# Altium project Iterptiniu semestrinis.PrjPcb
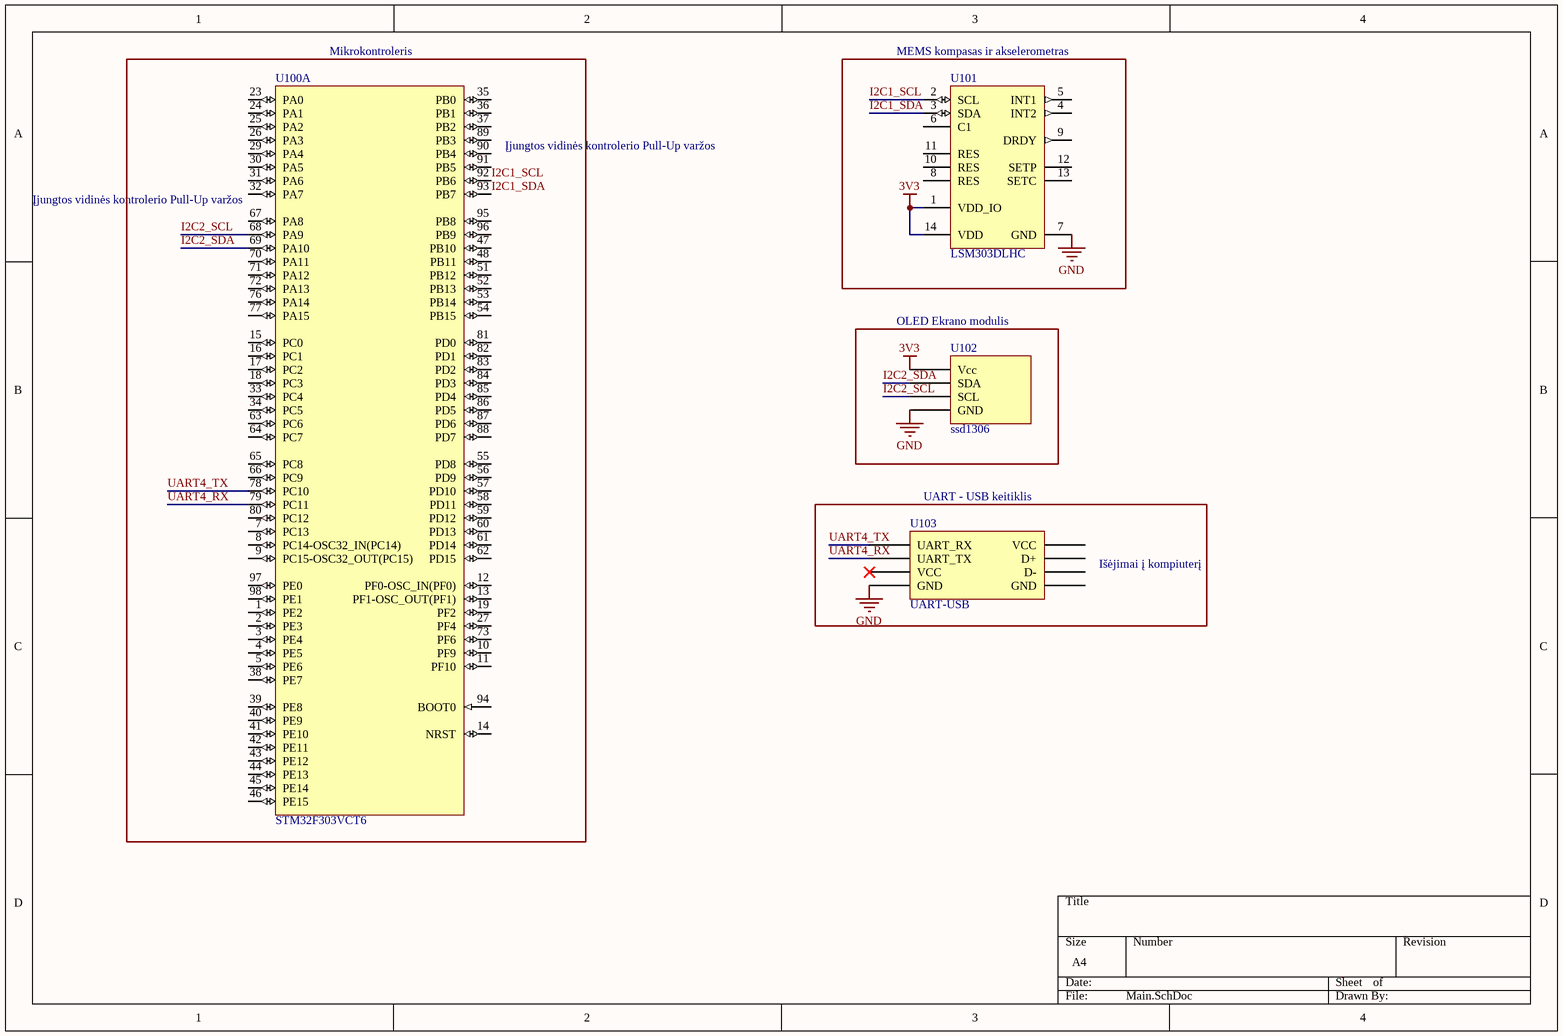
[diagram p0: Main.SchDoc]
1 sheet, 4 parts. Net scope: global (net labels, ports and power ports of the same name join across sheets).

## Sheet Main.SchDoc
size A4; SheetNumber: 1; SheetTotal: 1

### Parts
U100  STM32F303VCT6  [STM-LQFP100_L]  (part A of 2)
U101  LSM303DLHC  [STM-LGA14-3X5X1]
U102  ssd1306
U103  UART-USB

### Blocks framed on the sheet
MEMS kompasas ir akselerometras: U101
OLED Ekrano modulis: U102

### Nets
3V3: U101.1(VDD_IO) U101.14(VDD) U102.9(Vcc)
GND: U101.7(GND) U102.12(GND) U103.30(GND)
I2C1_SCL: U100.92(PB6) U101.2(SCL)
I2C1_SDA: U100.93(PB7) U101.3(SDA)
I2C2_SCL: U100.68(PA9) U102.11(SCL)
I2C2_SDA: U100.69(PA10) U102.10(SDA)
UART4_RX: U100.79(PC11) U103.28(UART_TX)
UART4_TX: U100.78(PC10) U103.27(UART_RX)

Not connected (* = marked no-connect by the designer): U100 1(PE2) 2(PE3) 3(PE4) 4(PE5) 5(PE6) 7(PC13) 8(PC14-OSC32_IN(PC14)) 9(PC15-OSC32_OUT(PC15)) 10(PF9) 11(PF10) 12(PF0-OSC_IN(PF0)) 13(PF1-OSC_OUT(PF1)) 14(NRST) 15(PC0) 16(PC1) 17(PC2) 18(PC3) 19(PF2) 23(PA0) 24(PA1) 25(PA2) 26(PA3) 27(PF4) 29(PA4) 30(PA5) 31(PA6) 32(PA7) 33(PC4) 34(PC5) 35(PB0) 36(PB1) 37(PB2) 38(PE7) 39(PE8) 40(PE9) 41(PE10) 42(PE11) 43(PE12) 44(PE13) 45(PE14) 46(PE15) 47(PB10) 48(PB11) 51(PB12) 52(PB13) 53(PB14) 54(PB15) 55(PD8) 56(PD9) 57(PD10) 58(PD11) 59(PD12) 60(PD13) 61(PD14) 62(PD15) 63(PC6) 64(PC7) 65(PC8) 66(PC9) 67(PA8) 70(PA11) 71(PA12) 72(PA13) 73(PF6) 76(PA14) 77(PA15) 80(PC12) 81(PD0) 82(PD1) 83(PD2) 84(PD3) 85(PD4) 86(PD5) 87(PD6) 88(PD7) 89(PB3) 90(PB4) 91(PB5) 94(BOOT0) 95(PB8) 96(PB9) 97(PE0) 98(PE1); U101 4(INT2) 5(INT1) 6(C1) 8(RES) 9(DRDY) 10(RES) 11(RES) 12(SETP) 13(SETC); U103 29(VCC)* 31(VCC) 32(D+) 33(D-) 34(GND)

### Notes on the sheet
- (near U100) Mikrokontroleris
- (near U100) Įjungtos vidinės kontrolerio Pull-Up varžos
- (near U103) UART - USB keitiklis
- Išėjimai į kompiuterį

### Library data of the parts
U100 = CMP-0572-00009-2: ARM Cortex-M4 32-bit MCU, 256 KB Flash, 40 KB Internal RAM, 87 I/Os, 100-pin LQFP, -40 to 85 degC, Tray; Internal RAM Size (kB): 40; FLASH Size (Prog) (kB): 256; Supply Voltage(Vcc) min (V): 2; I/Os (High Current): 87; Operating Frequency(F) (Processor speed) (MHz): 72; D/A Converter: 2x12-bit (2 Channel); ComponentLink2URL: http://www.st.com/st-web-ui/static/active/en/resource/technical/document/datasheet/DM00058181.pdf; PackageVersion: Rev. 1, 06/2013; ComponentLink2Description: Datasheet; DatasheetVersion: Rev. 6; Packing: Tray; ComponentLink3Description: Package Specification; Mounting Technology: Surface Mount; PackageReference: LQFP100; ComponentLink1URL: http://www.st.com/web/en/home.html; ComponentLink3URL: http://www.st.com/st-web-ui/static/active/en/resource/technical/document/data_brief/DM00071938.pdf; PackageDescription: 100-Pin Low Profile Quad Flat Package, 14 x 14 mm Body, 0.5 mm Pitch; ComponentLink1Description: Manufacturer URL; PartNumber: STM32F303VCT6; Core: ARM Cortex-M4
U101 = CMP-0234-00038-2: Ultra compact high performance e-compass: 3D accelerometer and 3D magnetometer module, -40 to +85°C, LGA-14 (3x5x1), Tray; PackageVersion: 2011; DatasheetVersion: rev1, Apr-2011; ComponentLink1Description: LSM303DLHC Datasheet; ComponentLink2URL: http://www.st.com/internet/analog/product/251940.jsp; PackageReference: LGA14-3X5X1; PackageDescription: 14-Lead Land Grid Array Package, 5 x 3 x 1 mm Body, 0.8 mm Pitch; ComponentLink3Description: st.com Home; ComponentLink3URL: http://www.st.com/internet/com/home/home.jsp; ComponentLink1URL: http://www.st.com/internet/com/TECHNICAL_RESOURCES/TECHNICAL_LITERATURE/DATASHEET/DM00027543.pdf; ComponentLink2Description: LSM303DLHC Web Page